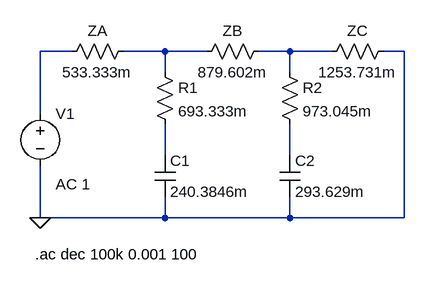
[diagram p0: schematic 1.asc]
1.asc, the LTspice schematic file:
Version 4
SHEET 1 880 740
WIRE 240 32 192 32
WIRE 384 32 320 32
WIRE 448 32 384 32
WIRE 576 32 528 32
WIRE 640 32 576 32
WIRE 752 32 720 32
WIRE 384 64 384 32
WIRE 576 64 576 32
WIRE 192 128 192 32
WIRE 384 192 384 144
WIRE 576 192 576 144
WIRE 192 288 192 208
WIRE 384 288 384 256
WIRE 384 288 192 288
WIRE 576 288 576 256
WIRE 576 288 384 288
WIRE 752 288 752 32
WIRE 752 288 576 288
FLAG 192 288 0
SYMBOL voltage 192 112 R0
WINDOW 123 24 124 Left 2
WINDOW 39 0 0 Left 0
SYMATTR Value2 AC 1
SYMATTR InstName V1
SYMATTR Value ""
SYMBOL res 368 48 R0
SYMATTR InstName R1
SYMATTR Value 693.333m
SYMBOL res 560 48 R0
SYMATTR InstName R2
SYMATTR Value 973.045m
SYMBOL cap 368 192 R0
SYMATTR InstName C1
SYMATTR Value 240.3846m
SYMBOL cap 560 192 R0
SYMATTR InstName C2
SYMATTR Value 293.629m
SYMBOL res 336 16 R90
WINDOW 0 0 56 VBottom 2
WINDOW 3 32 56 VTop 2
SYMATTR InstName ZA
SYMATTR Value 533.333m
SYMBOL res 544 16 R90
WINDOW 0 0 56 VBottom 2
WINDOW 3 32 56 VTop 2
SYMATTR InstName ZB
SYMATTR Value 879.602m
SYMBOL res 736 16 R90
WINDOW 0 0 56 VBottom 2
WINDOW 3 32 56 VTop 2
SYMATTR InstName ZC
SYMATTR Value 1253.731m
TEXT 184 344 Left 2 !.ac dec 100k 0.001 100

The netlist it stands for:
* 1.asc
V1 N001 0 AC 1
R1 N002 N004 693.333m
R2 N003 N005 973.045m
C1 N004 0 240.3846m
C2 N005 0 293.629m
R§ZA N002 N001 533.333m
R§ZB N003 N002 879.602m
R§ZC 0 N003 1253.731m
.ac dec 100k 0.001 100
.backanno
.end